# EAGLE design TDRPulseGen_RevC (EAGLE 7.2.0)
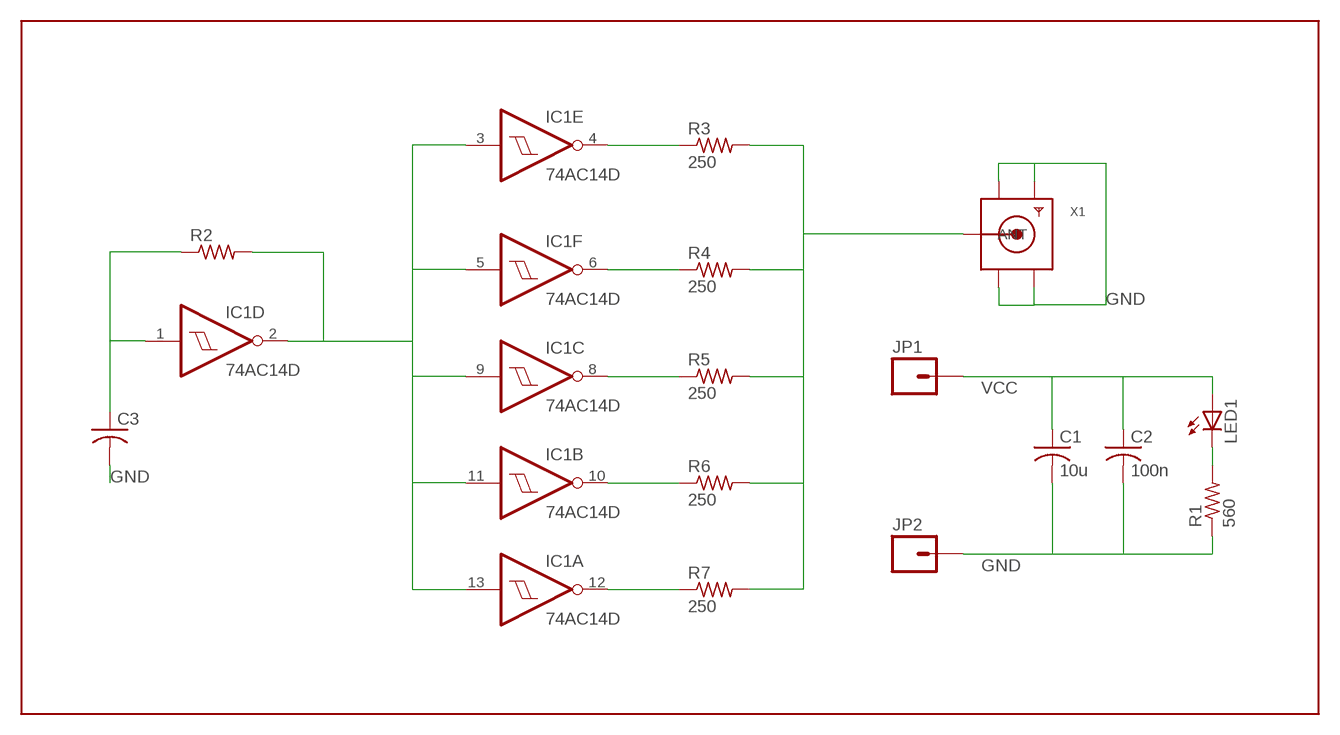
[diagram p0: schematic, sheet 1]

## Parts
C1  10u  C-USC0805  [C0805]
C2  100n  C-USC0805  [C0805]
C3  C-USC0805  [C0805]
IC1  74AC14D  [SO14]
JP1  M01PTH  [1X01]
JP2  M01PTH  [1X01]
LED1  LEDCHIPLED_0805  [CHIPLED_0805]
R1  560  R-US_R0805  [R0805]
R2  R-US_R0805  [R0805]
R3  250  R-US_R0805  [R0805]
R4  250  R-US_R0805  [R0805]
R5  250  R-US_R0805  [R0805]
R6  250  R-US_R0805  [R0805]
R7  250  R-US_R0805  [R0805]
X1  SMACONNECTOR  [SMA90_DIP]

## Nets
GND: C1.2 C2.2 C3.2 JP2.1 R1.1 X1.GND1 X1.GND2 X1.GND3 X1.GND4
N$1: IC1.2(D:O) IC1.3(E:I) IC1.5(F:I) IC1.9(C:I) IC1.11(B:I) IC1.13(A:I) R2.2
N$2: C3.1 IC1.1(D:I) R2.1
N$3: IC1.4(E:O) R3.1
N$4: LED1.C R1.2
N$5: IC1.6(F:O) R4.1
N$6: IC1.8(C:O) R5.1
N$7: IC1.10(B:O) R6.1
N$8: IC1.12(A:O) R7.1
N$9: R3.2 R4.2 R5.2 R6.2 R7.2 X1.ANTENNA(ANT)
VCC: C1.1 C2.1 JP1.1 LED1.A

## Power pins joined to a net without a drawn wire
GND: IC1.7(P:GND)
VCC: IC1.14(P:VCC)

## Library data of the parts
C1-C3 = adafruit:C-US: CAPACITOR, American symbol
IC1 = 74xx-eu:74*14: Hex schmitt trigger INVERTER
JP1 JP2 = SparkFun-Connectors:M01: Header 1 Standard 1-pin 0.1" header. Use with straight break away headers (SKU : PRT-00116), right angle break away headers (PRT-00553), swiss pins (PRT-00743), machine pins (PRT-00117), and female headers (PRT-00115).
LED1 = adafruit:LED: LED OSRAM: - CHIPLED LG R971, LG N971, LY N971, LG Q971, LY Q971, LO R971, LY R971 LH N974, LH R974 LS Q976, LO Q976, LY Q976 LO Q996 - Hyper CHIPLED LW Q18S LB Q993, LB Q99A, LB R99A - SideLED LS A670, LO A670, LY A670, LG A670, LP A670 LB A673, LV A673, LT A673, LW A673 LH A674 LY A675 LS A676, LA A676, LO A676, LY A676, LW A676 LS A679, LY A679, LG A679 - Hyper Micro SIDELED® LS Y876, LA Y876, LO Y876, LY Y876 LT Y87S - SmartLED LW L88C, LW L88S LB L89C, LB L89S, LG L890 LS L89K, LO L89K, LY L89K LS L896, LA L896, LO L896, LY L896 - TOPLED LS T670, LO T670, LY T670, LG T670, LP T670 LSG T670, LSP T670, LSY T670, LOP T670, LYG T670 LG T671, LOG T671, LSG T671 LB T673, LV T673, LT T673, LW T673 LH T674 LS T676, LA T676, LO T676, LY T676, LB T676, LH T676, LSB T676, LW T676 LB T67C, LV T67C, LT T67C, LS T67K, LO T67K, LY T67K, LW E67C LS E67B, LA E67B, LO E67B, LY E67B, LB E67C, LV E67C, LT E67C LW T67C LS T679, LY T679, LG T679 LS T770, LO T770, LY T770, LG T770, LP T770 LB T773, LV T773, LT T773, LW T773 LH T774 LS E675, LA E675, LY E675, LS T675 LS T776, LA T776, LO T776, LY T776, LB T776 LHGB T686 LT T68C, LB T68C - Hyper Mini TOPLED® LB M676 - Mini TOPLED Santana® LG M470 LS M47K, LO M47K, LY M47K Source: http://www.osram.convergy.de/
R1-R7 = adafruit:R-US_: RESISTOR, American symbol
X1 = adafruit:SMACONNECTOR: SMA Connector 90° DIP SMA Connector, 50 Ohm (4UConnector: 07259)

## Board
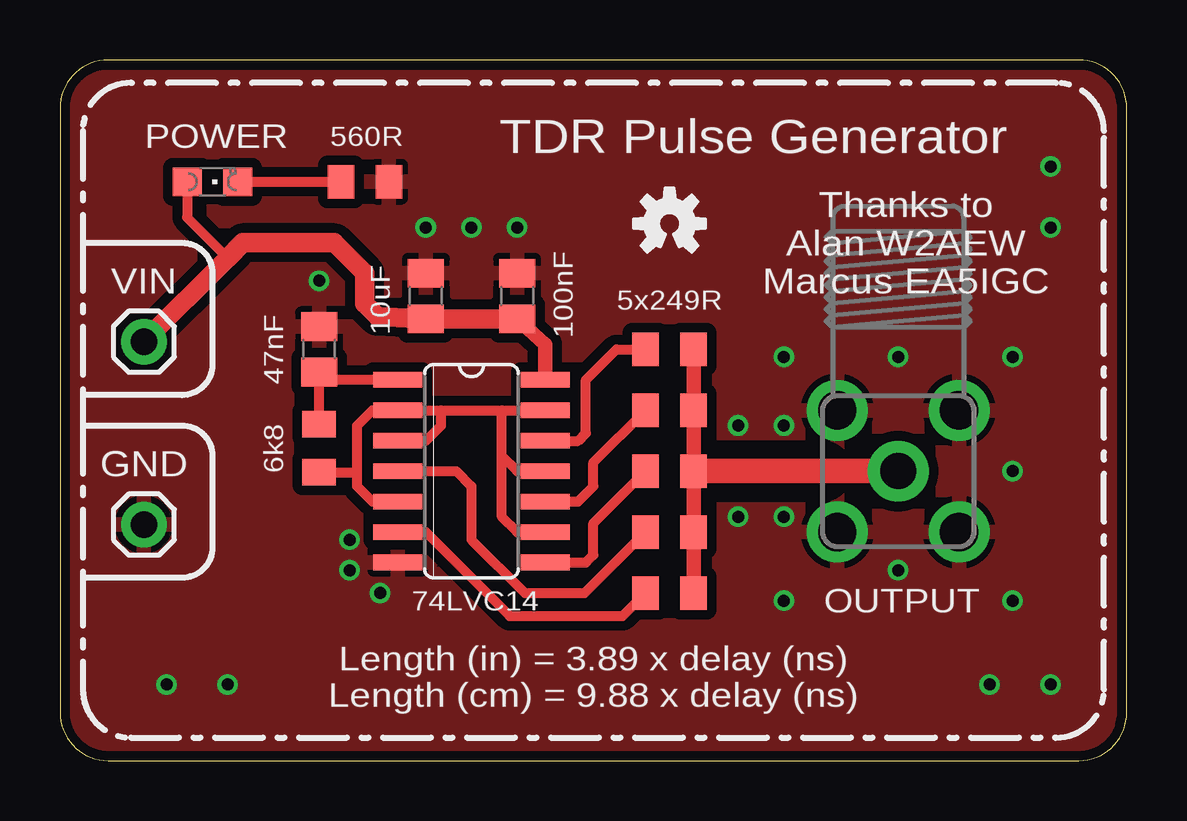
[diagram p1: board, top side]
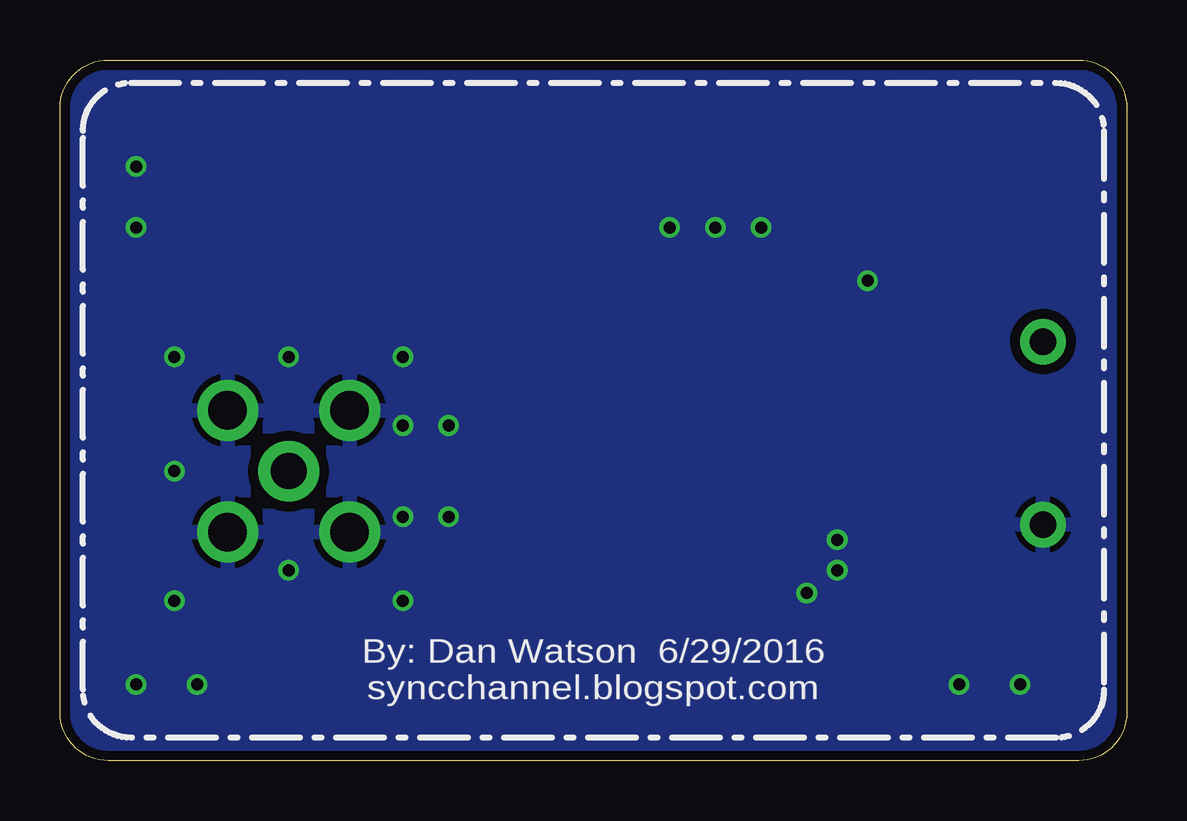
[diagram p2: board, bottom side, seen from below]

Size 44.45 x 29.21 mm. Coordinates in mm from the lower left corner, seen from the top.
Outline: 2,0 42.45,0 arc90 44.45,2 44.45,27.21 arc90 42.45,29.21 2,29.21 arc90 0,27.21 0,2 arc90 2,0
Copper layers (1*16): Top 0.0356mm / dielectric 1.5011mm / Bottom 0.0356mm
Design rules "oshpark-2layer *": minimum track width 6mil, minimum drill 13mil, track to track 6mil, track to pad 6mil, pad to pad 6mil, via to via 6mil, smd to smd 6mil, copper to edge 15mil, drill to drill 6mil, minimum pad ring 7mil, minimum via ring 7mil, stop-mask expansion 4mil, vias tented up to drill 20mil, thermal gap 10mil
tRestrict: 3 lines

### Footprints (pad centres in the part's own frame; a part is rotated, then mirrored left to right if it is on the bottom)
C0805 = smd 1.2 x 1.5: 1 -0.95,0; 2 0.95,0
SO14 = smd 0.66 x 2.032: 1 -3.81,-3.073; 2 -2.54,-3.073; 3 -1.27,-3.073; 4 0,-3.073; 5 1.27,-3.073; 6 2.54,-3.073; 7 3.81,-3.073; 8 3.81,3.073; 9 2.54,3.073; 10 1.27,3.073; 11 0,3.073; 12 -1.27,3.073; 13 -2.54,3.073; 14 -3.81,3.073
1X01 = drill 1.1 pad 1.9: 1 0,0
CHIPLED_0805 = smd 1.2 x 1.2: A 0,-1.05; C 0,1.05
R0805 = smd 1.1 x 1.4: 1 -1,0; 2 1,0
SMA90_DIP = drill 1.5 pad 2.54: ANTENNA 0,0 | drill 1.6 pad 2.54: GND1 -2.54,2.54; GND2 2.54,2.54; GND3 -2.54,-2.54; GND4 2.54,-2.54

### Placement (x,y rotation side)
C1  15.24,19.37 90 top
C2  19.05,19.37 90 top
C3  10.79,17.14 90 top
IC1  17.14,12.06 270 top
JP1  3.49,17.46 0 top
JP2  3.49,9.84 0 top
LED1  6.35,24.13 270 top
R1  12.7,24.13 180 top
R2  10.79,13.02 270 top
R3  25.4,9.53 0 top
R4  25.4,6.99 0 top
R5  25.4,12.06 0 top
R6  25.4,14.61 0 top
R7  25.4,17.14 0 top
U$2  [OSHW-LOGO-S]  25.4,22.38 0 top
X1  34.92,12.06 0 top

### Tracks (layer width: path | path; a pad name or v marks a point on that pad's centre or on a via)
GND  (via drill 0.5)
  other vias: 28.26,13.97 30.16,13.97 28.26,10.16 30.16,10.16 15.24,22.23 17.14,22.23 12.06,7.94 13.34,6.99 39.69,12.06 34.92,16.83 34.92,7.94 19.05,22.23 10.79,20 12.06,9.21 38.73,3.17 41.27,3.17 41.27,24.77 41.27,22.23 4.45,3.17 6.99,3.17 30.16,16.83 39.69,16.83 30.16,6.67 39.69,6.67
  pour Top (isolate 0.406): -1.27,30.48 -1.27,0 45.72,0 45.72,30.48
  pour Bottom (isolate 0.406): -2.54,31.75 -2.54,-1.27 46.99,-1.27 46.99,31.75
N$1
  Top 0.406: 15.88,14.61 IC1.2 13.02,14.61 12.38,13.97 12.38,12.06 | 15.88,14.61 18.41,14.61 | 18.41,14.61 IC1.13 | IC1.11 19.05,12.06 18.41,12.7 | 18.41,12.7 18.41,14.61 | IC1.9 19.05,9.53 18.41,10.16 18.41,12.7 | IC1.3 15.24,13.34 15.88,13.97 15.88,14.61 | IC1.5 13.02,10.79 12.38,11.43 12.38,12.06 | R2.2 12.34,12.02 12.38,12.06
N$2
  Top 0.406: R2.1 C3.1 11.21,15.88 IC1.1
N$3
  Top 0.406: IC1.4 16.51,12.06 17.14,11.43 17.14,9.21 19.37,6.99 21.86,6.99 R3.1
N$4
  Top 0.406: LED1.C R1.2
N$5
  Top 0.406: IC1.6 15.24,9.53 18.73,6.03 23.45,6.03 R4.1
N$6
  Top 0.406: IC1.8 21.91,8.26 22.23,8.57 22.23,9.89 R5.1
N$7
  Top 0.406: IC1.10 21.59,10.79 22.23,11.43 22.23,12.43 R6.1
N$8
  Top 0.406: IC1.12 21.59,13.34 21.91,13.65 21.91,15.88 23.18,17.14 R7.1
N$9
  Top 0.406: R5.2 26.67,12.06
  Top 0.61: R7.2 R6.2 R5.2 R3.2 R4.2
  Top 1.016: 26.67,12.06 X1.ANTENNA
VCC
  Top 0.406: LED1.A 5.3,22.64 6.99,20.95
  Top 0.61: IC1.14 20.22,17.35 C2.1
  Top 0.813: C2.1 C1.1 13.23,18.52 12.7,19.05 12.7,20.32 11.43,21.59 7.62,21.59 6.99,20.95 JP1.1

### Text on the board
tNames: POWER | 560R | TDR Pulse Generator | Thanks to / Alan W2AEW / Marcus EA5IGC | VIN | 10uF | 100nF | 5x249R | 47nF | 6k8 | GND | 74LVC14 | OUTPUT | Length (in) = 3.89 x delay (ns) / Length (cm) = 9.88 x delay (ns)
bNames: By: Dan Watson 6/29/2016 / syncchannel.blogspot.com